# Altium project motion_board.PrjPcb
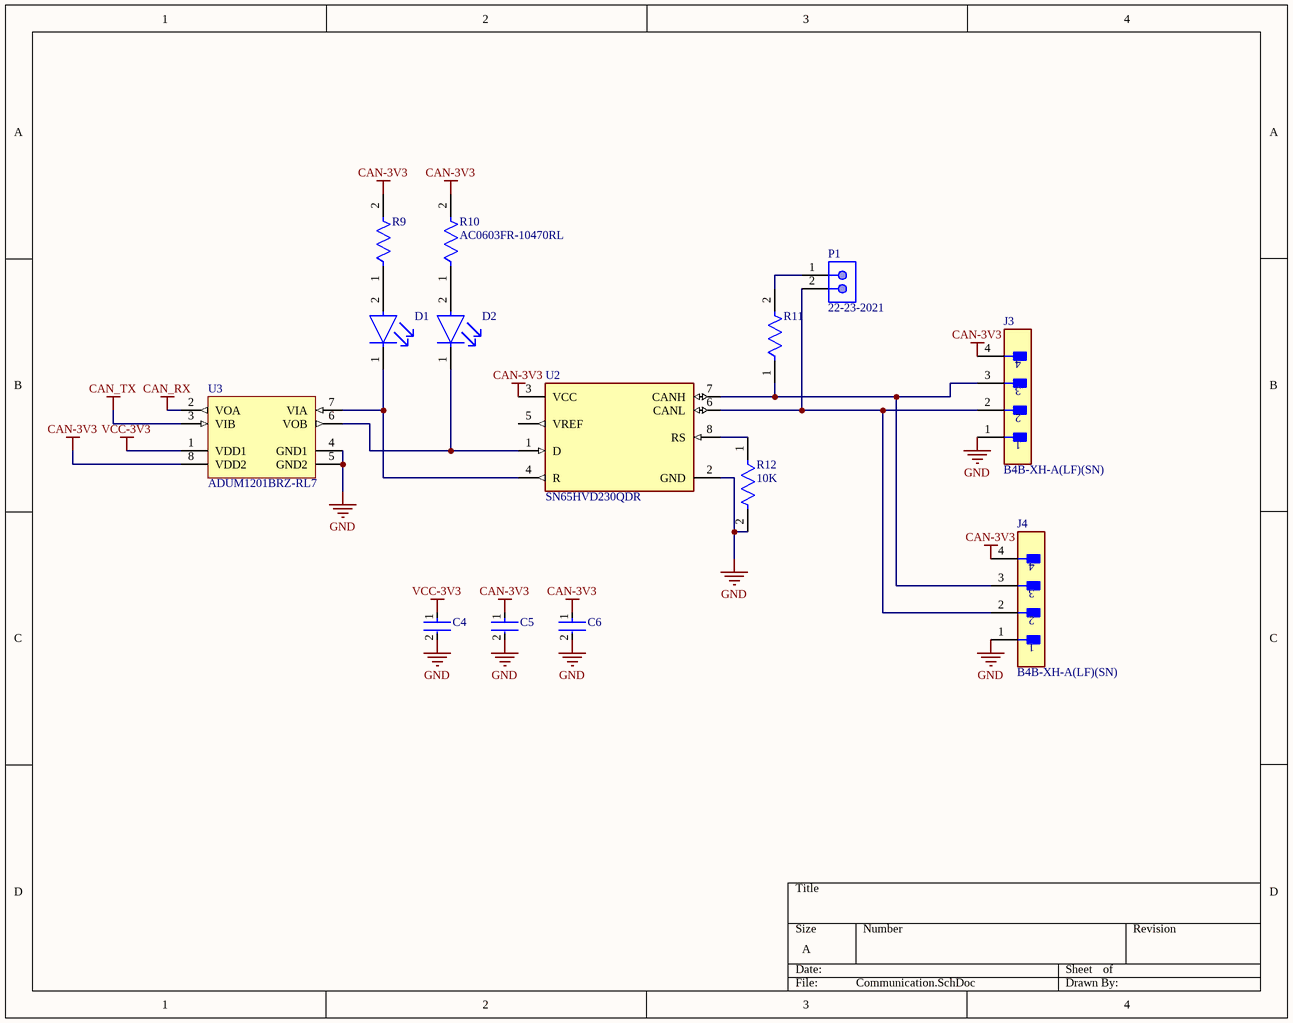
[diagram p0: Communication.SchDoc]
10 sheets, 62 parts. Net scope: global (net labels, ports and power ports of the same name join across sheets).
Board file: PCB_new.PcbDoc
Sheets:
  Communication.SchDoc
  MotorEncoders.SchDoc
  OdomEncoders.SchDoc
  Power.SchDoc
  STM32.SchDoc
  VoltageRegulator_3v3.SchDoc
  STLink.SchDoc
  MotorShield.SchDoc
  Oscilator.SchDoc
  IMU.SchDoc

## Sheet Communication.SchDoc
size A; SheetNumber: 1; SheetTotal: 10

### Parts
C4  CC0603KRX7R9BB104  [FP-CC0603-DA-MFG]  (value not drawn)
C5  CC0603KRX7R9BB104  [FP-CC0603-DA-MFG]  (value not drawn)
C6  CC0603KRX7R9BB104  [FP-CC0603-DA-MFG]  (value not drawn)
D1  APHCM2012CGCK-F01  [FP-APHCM2012CGCK-F01-MFG]  (value not drawn)
D2  APHCM2012CGCK-F01  [FP-APHCM2012CGCK-F01-MFG]  (value not drawn)
J3  B4B-XH-A(LF)(SN)  [FP-B4B-XH-A_LF_SN-MFG]
J4  B4B-XH-A(LF)(SN)  [FP-B4B-XH-A_LF_SN-MFG]
P1  22-23-2021  [MOLX-22-23-2021_V]
R9  AC0603FR-10470RL  [FP-AC0603-IPC_A]  (value not drawn)
R10  AC0603FR-10470RL  [FP-AC0603-IPC_A]
R11  RT0603FRE07120RL  [FP-RT0603-MFG]  (value not drawn)
R12  10K  [FP-RC0603-0_55-IPC_C]
U2  SN65HVD230QDR  [FP-D0008A-IPC_C]
U3  ADUM1201BRZ-RL7  [ADI-R-8_L]

### Nets
CAN-3V3: C5.1 C6.1 J3.4 J4.4 R9.2 R10.2 U2.3(VCC) U3.8(VDD2)
CAN_RX: U3.2(VOA)
CAN_TX: U3.3(VIB)
GND: C4.2 C5.2 C6.2 J3.1 J4.1 R12.2 U2.2(GND) U3.4(GND1) U3.5(GND2)
VCC-3V3: C4.1 U3.1(VDD1)
NetD1_1: D1.1(C) U2.4(R) U3.7(VIA)
NetD1_2: D1.2(A) R9.1
NetD2_1: D2.1(C) U2.1(D) U3.6(VOB)
NetD2_2: D2.2(A) R10.1
NetJ3_2: J3.2 J4.2 P1.2 U2.6(CANL)
NetJ3_3: J3.3 J4.3 R11.1 U2.7(CANH)
NetP1_1: P1.1 R11.2
NetR12_1: R12.1 U2.8(RS)

Not connected (* = marked no-connect by the designer): U2 5(VREF)

### Library data of the parts
C4-C6 = CMP-2100-03601-2: CAP CER 0.1UF 50V X7R 0603; Manufacturer: YAGEO; Material: Ceramic; Capacitance: 100 nF; Temperature Coefficient: 15%; Tolerance: 0.1; Value: 100 nF; Height: 0.9mm; Voltage: 50 V; ComponentLink2Description: Datasheet; Device Class L2: Capacitors; Temperature Range High: +125°C; Category: Cap; Footprint Url: http://www.yageo.com/exep/pages/download/literatures/UPY-C_GEN_24.pdf; ComponentLink2URL: http://www.yageo.com/documents/recent/UPY-GPHC_X7R_6.3V-to-50V_18.pdf; Package: CC0603-DA; Temperature: -55°C to +125°C; Voltage Rating: 50 V; Temperature Characteristic: X7R; Device Class L1: Passive Components; Temperature Range Low: -55°C; Manufacturer Part Number: CC0603KRX7R9BB104; RoHS: TRUE; Automotive: No; Device Class L3: Ceramic Capacitors; Octopart: https://octopart.com/cc0603krx7r9bb104-yageo-42244635; Mouser Description: Multilayer Ceramic Capacitor, CC Series, 0.1 - F, - 10%, X7R, 50 V, 0603 [1608 Metric]; Lead Free: Yes; Digikey Description: CAP CER 0.1UF 50V X7R 0603
D1 D2 = CMP-44529-000062-1: LED GREEN CLEAR CHIP SMD; Dominant Wavelength: 570nm; Forward Current: 20mA; Number of LEDs: 1; Luminous Intensity: 40mcd; Forward Voltage: 2.1V; Viewing Angle: 110°; Illumination Color: Green; Lens Style: Clear; Mount: Surface Mount; Length: 2mm; Max Operating Temperature: 85°C; Series: APHCM; Width: 1.25mm; Lead Free: Lead Free; Wavelength: 570nm; Package Quantity: 1; Number of Pins: 2; Case Code (Metric): 2012; RoHS Compliant: Yes; Packaging: Tape and Reel; Lens Color: Clear; Case/Package: 0805; Case Code (Imperial): 0805; Test Current: 20mA; Color: Green; Min Operating Temperature: -40°C; Height: 0.4mm
J3 J4 = CMP-17439-000250-1: CONN HEADER VERT 4POS 2.5MM; Number of Contacts: 4; Contact Resistance: 20mR; Voltage Rating: 250V; Max Current Rating: 3A; Gender: Male; Wire/Cable Gauge: 22AWG; Mated Stacking Heights: 9.8mm; Insulation Resistance: 1GR; Orientation: Straight; Contact Type: Male Pin; Contact Finish - Mating: TIN; Series: XH; Max Voltage Rating (AC): 250V; Lead Pitch: 2.5mm; Contact Shape: Square; Insulation Color: Natural; Termination: Solder; Lead Free: Lead Free; Voltage Rating (AC): 250V; Number of Rows: 1; Flammability Rating: UL94 V-0; Number of Positions: 4; Max Operating Temperature: 85°C; Package Quantity: 500; Mount: Through Hole; REACH SVHC: No SVHC; Connector Type: Header; Insulation Material: Nylon; Fastening Type: Detent; Min Operating Temperature: -25°C; Housing Color: White; Packaging: Bulk; Contact Plating: Tin; Contact Material: Brass; Max Voltage Rating (DC): 250V; Housing Material: Polyamide; Color: Natural; Material: Polyamide; Pitch: 2.5mm; Depth: 5.75mm; Current Rating: 3A; Length: 12.4mm
P1 = CMP-1704-00001-3: Male Header, Pitch 2.54 mm, 1 x 2 Position, Height 10.67 mm, Tail Length 3.56 mm, 0 to 75 degC, RoHS, Bulk; Package Quantity: 3000; Height: 10.67 mm; RoHSCompliant: True; ComponentLink2URL: https://datasheet.ciiva.com/19454/232266-19454304.pdf; PartNumber: 22-23-2021; Packaging: Bulk; ComponentLink2Description: Datasheet; Min Operating Temperature: 0 degC; ComponentLink1Description: Manufacturer URL; Length: 5.08 mm; Mounting Technology: Through Hole; Max Operating Temperature: 75 degC; REACH SVHC: Unknown; PackageDescription: Male Header, Pitch 2.54 mm, 1 x 2 Position, Height 10.67 mm, Tail Length 3.56 mm; ComponentLink1URL: http://www.molex.com/; Mount: Through Hole; Radiation Hardening: No; Width: 6.35 mm; Pins: 2
R9 R10 = CMP-03412-002877-2: RES 470Ω 1.00% 0.1W 0603; Tolerance: 1%; Resistance: 470R; Case/Package: 0603; RoHS Compliant: Yes
R11 = CMP-03412-010455-1: RES SMD 120 OHM 1% 1/10W 0603; Manufacturer: Yageo; Voltage Rating: 75V; Resistance: 120Ω; Value: 120Ω; Temperature Coefficient: 50 ppm/°C; Power Rating: 0.1W; Tolerance: 0.01; Ipc Land Pattern Name: RESC16080X45; Category: Res; Mouser Description: High Precision-High Stability Chip Resistor Thin Film 0603 120Ohm 1% Paper T/R; Series: RT; Device Class L1: Passive Components; Height: 0.55mm; Composition: Thin Film; Temperature Range High: +155°C; Octopart: https://octopart.com/rt0603fre07120rl-yageo-40001924; RoHS: TRUE; Footprint Url: http://www.yageo.com/exep/pages/download/literatures/PYu-R_Mount_10.pdf; Manufacturer Part Number: RT0603FRE07120RL; Device Class L3: Chip SMD Resistors; Lead Free: Yes; Digikey Description: RES SMD 120 OHM 1% 1/10W 0603; ComponentLink2Description: Datasheet; Temperature: -55°C to +155°C; Package: RT0603; Device Class L2: Resistors; ComponentLink2URL: http://www.yageo.com/documents/recent/PYu-RT_1-to-0.01_RoHS_L_9.pdf; Temperature Range Low: -55°C; Automotive: No; JLCPCB: 0603WAF1200T5E
R12 = CMP-2100-03664-2: RES 10K OHM 1% 1/10W 0603; Voltage Rating: 75V; Voltage Rating (DC): 50V; Resistance: 10kR; Power Rating: 100mW; Temperature Coefficient: 100ppm/°C; Depth: 0.8mm; Termination: SMD/SMT; Resistor Type: Thick Film; Series: RC; Construction: Rectangular; Features: Moisture Resistant; Packaging: Tape and Reel; Min Operating Temperature: -55°C; Number of Terminations: 2; Lead Pitch: 0.3mm; RoHS Compliant: Yes; Case/Package: 0603; Resistance Tolerance: 1%; Military Standard: Not; Weight: 7.1E-05oz; Number of Pins: 2; Tolerance: 1%; Length: 1.6mm; Case Code (Imperial): 0603; Lead Free: Lead Free; Width: 0.8mm; Max Power Dissipation: 100mW; Height: 0.45mm; Max Operating Temperature: 155°C; Case Code (Metric): 1608; Size Code: 0603
U2 = CMP-0315-00033-3: IC TRANSCEIVER HALF 1/1 8SOIC; Max Supply Current: 17mA; Number of Receivers: 1; Data Rate: 1Mbps; Simplex/Duplex: Half Duplex; Receiver Hysteresis: 100mV; Min Supply Voltage: 3V; Max Supply Voltage: 3.6V; Operating Supply Voltage: 3.3V; Number of Pins: 8; RoHS Compliant: Yes; Case/Package: D; Number of Drivers: 1; Packaging: Tape and Reel; Weight: 0.002822oz; Max Operating Temperature: 125°C; Package Quantity: 2500; Min Operating Temperature: -40°C; Nominal Supply Current: 17mA; Radiation Hardening: No; Number of Transceivers: 1; Contact Plating: Gold; Lead Free: Lead Free
U3 = CMP-0534-00027-1: Dual Channel Digital Isolator, 2.5 KV rms Insulation Rating, 10 Mbps Data Rate, 50 ns Delay, Industrial, 8-pin SOIC (R-8), Reel; Manufacturer: Analog Devices; Insulation Rating (kVrms): 2.5; Max Data Rate: 10Mbps; Code_JEDEC: MS-012-AA; ComponentLink3URL: http://www.analog.com/static/imported-files/packages/PKG_PDF/SOIC_Narrow%20(R)/R_8.pdf; PackageDescription: 8-Pin Standard Small Outline Package, Body 4.9 x 3.9 mm, Pitch 1.27 mm; ComponentLink2URL: http://www.analog.com/static/imported-files/data_sheets/ADuM1200_1201.pdf; DatasheetVersion: Rev. I; ComponentLink1URL: http://www.analog.com/en/index.html; PartNumber: ADUM1201BRZ-RL7; Mounting Technology: Surface Mount; ComponentLink3Description: Package Specification; ComponentLink1Description: Manufacturer URL; PackageVersion: 060506-A, 06/2006; ComponentLink2Description: Datasheet; Max Operating Temp (degreesC): 125; PackageReference: R-8; ComponentLink4URL: Product URL:http://www.analog.com/en/interface-isolation/digital-isolators/adum1201/products/product.html; ComponentLink4Description: URL Link1; ComponentLink5URL: Reference Circuit:http://www.analog.com/en/interface-isolation/digital-isolators/adum1201/products/product.html#product-recommendations; ComponentLink5Description: URL Link2

## Sheet MotorEncoders.SchDoc
size A; SheetNumber: 2; SheetTotal: 10
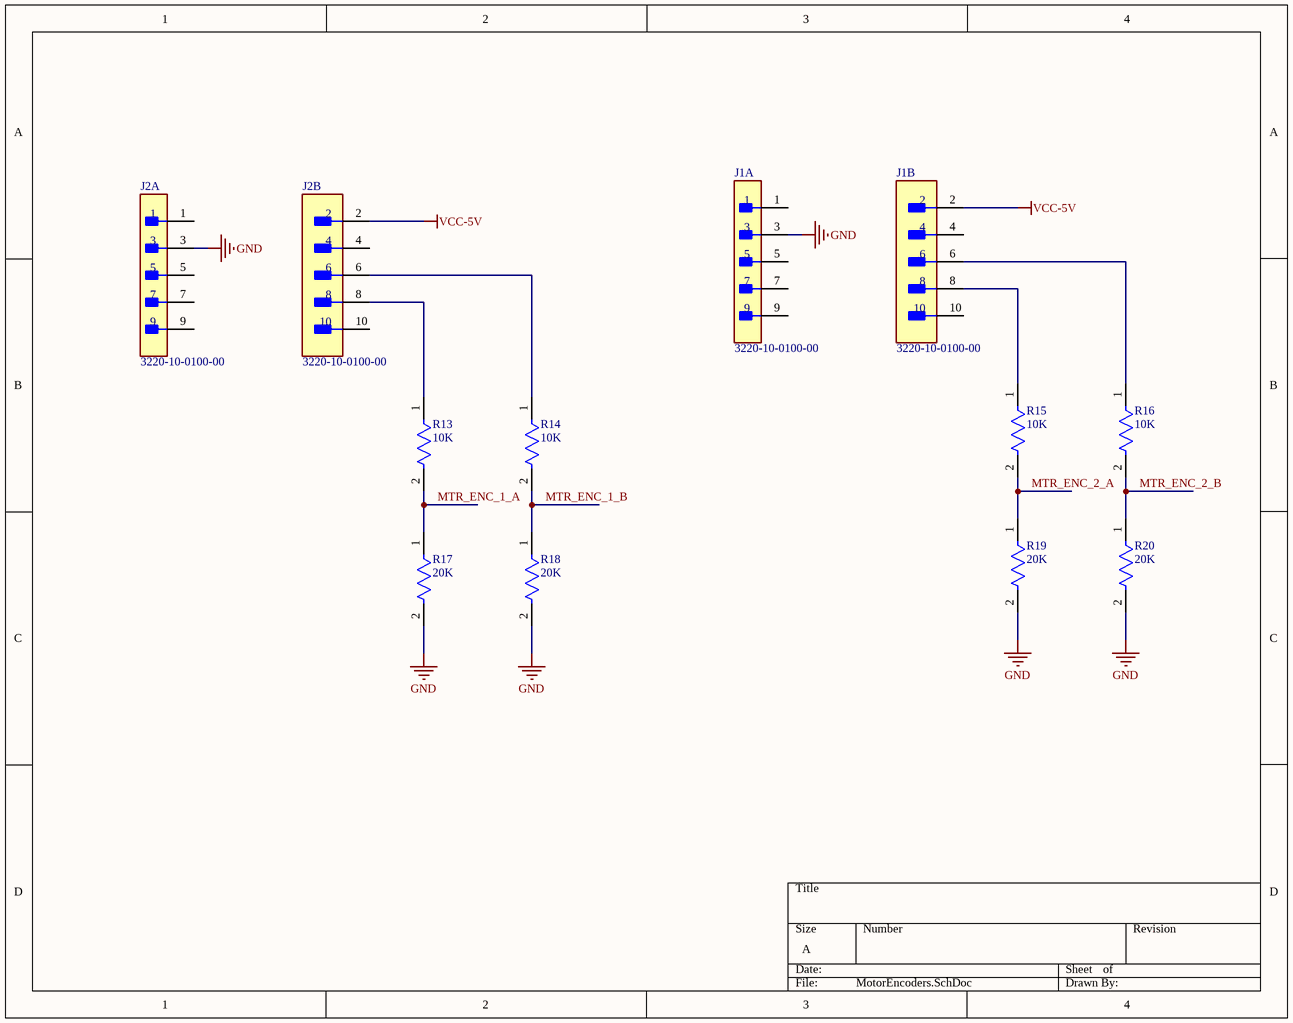
[diagram p1: MotorEncoders.SchDoc]

### Parts
J1  3220-10-0100-00  [FP-3220-10-0100-00-MFG]  (parts A,B of 2)
J2  3220-10-0100-00  [FP-3220-10-0100-00-MFG]  (parts A,B of 2)
R13  10K  [FP-RC0603-0_55-IPC_C]
R14  10K  [FP-RC0603-0_55-IPC_C]
R15  10K  [FP-RC0603-0_55-IPC_C]
R16  10K  [FP-RC0603-0_55-IPC_C]
R17  20K  [FP-RC0603-0_55-IPC_C]
R18  20K  [FP-RC0603-0_55-IPC_C]
R19  20K  [FP-RC0603-0_55-IPC_C]
R20  20K  [FP-RC0603-0_55-IPC_C]

### Nets
GND: J1.3 J2.3 R17.2 R18.2 R19.2 R20.2
VCC-5V: J1.2 J2.2
MTR_ENC_1_A: R13.2 R17.1
MTR_ENC_1_B: R14.2 R18.1
MTR_ENC_2_A: R15.2 R19.1
MTR_ENC_2_B: R16.2 R20.1
NetJ1_6: J1.6 R16.1
NetJ1_8: J1.8 R15.1
NetJ2_6: J2.6 R14.1
NetJ2_8: J2.8 R13.1

Not connected (* = marked no-connect by the designer): J1 1 4 5 7 9 10; J2 1 4 5 7 9 10

### Library data of the parts
J1 J2 = CMP-04151-26714221-1: 3220-10-0100-00 Conn Shrouded Header (4 Sides) HDR 10 POS 1.27mm Solder ST Top Entry Thru-Hole; Current Rating: 1A; Number of Contacts: 10; Connector Type: Male Pin; Contact Plating: Gold; Max Operating Temperature: 105°C; Contact Material: Gold; Number of Positions: 10; Pitch: 1.27mm; Number of Rows: 2; RoHS: Compliant; Row Spacing: 1.27mm; Min Operating Temperature: -40°C; Termination: Solder; NexarPartId: 26714221; Height: 5.6mm; Mount: Through Hole
R13-R16 = CMP-2100-03664-2: as R12 on sheet Communication; Depth: 0.8mm; Termination: SMD/SMT; Resistor Type: Thick Film; Series: RC; Construction: Rectangular; Features: Moisture Resistant; Packaging: Tape and Reel; Min Operating Temperature: -55°C; Number of Terminations: 2; Lead Pitch: 0.3mm; RoHS Compliant: Yes; Case/Package: 0603; Resistance Tolerance: 1%; Military Standard: Not; Weight: 7.1E-05oz; Number of Pins: 2; Tolerance: 1%; Length: 1.6mm; Case Code (Imperial): 0603; Lead Free: Lead Free; Width: 0.8mm; Max Power Dissipation: 100mW; Height: 0.45mm; Max Operating Temperature: 155°C; Case Code (Metric): 1608; Size Code: 0603
R17-R20 = CMP-2000-06932-2: RES 20K OHM 1% 1/10W 0603; Voltage Rating: 50V; Temperature Coefficient: 100ppm/°C; Power Rating: 100mW; Resistance: 20kR; Height: 0.022inch; REACH SVHC: No SVHC; Case Code (Metric): 1608; Depth: 0.8mm; Tolerance: 1%; Min Operating Temperature: -55°C; Series: RC; RoHS Compliant: Yes; Resistor Type: Thick Film; Max Power Dissipation: 100mW; Features: Moisture Resistant; Max Operating Temperature: 155°C; Package Quantity: 1; Size Code: 0603; Packaging: Tape and Reel; Width: 0.031inch; Length: 0.063inch; Military Standard: Not; Technology: THICK FILM; Number of Terminations: 2; Termination: SMD/SMT; Construction: Rectangular; Case/Package: 0603; Number of Pins: 2; Lead Free: Lead Free; Voltage Rating (DC): 50V; Resistance Tolerance: 1%; Case Code (Imperial): 0603

## Sheet OdomEncoders.SchDoc
size A; SheetNumber: 3; SheetTotal: 10
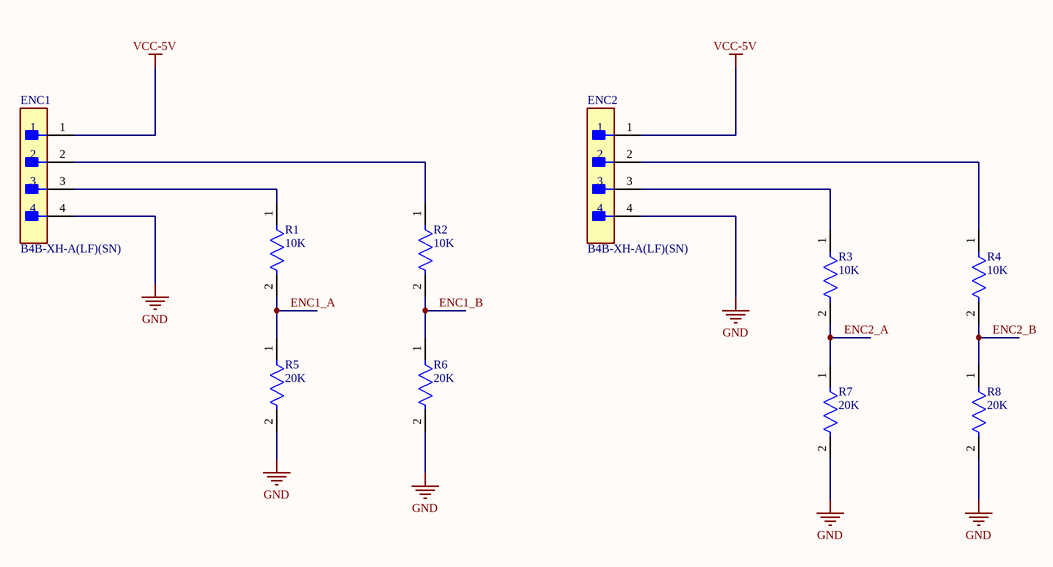
[diagram p2: OdomEncoders.SchDoc]

### Parts
ENC1  B4B-XH-A(LF)(SN)  [FP-B4B-XH-A_LF_SN-MFG]
ENC2  B4B-XH-A(LF)(SN)  [FP-B4B-XH-A_LF_SN-MFG]
R1  10K  [FP-RC0603-0_55-IPC_C]
R2  10K  [FP-RC0603-0_55-IPC_C]
R3  10K  [FP-RC0603-0_55-IPC_C]
R4  10K  [FP-RC0603-0_55-IPC_C]
R5  20K  [FP-RC0603-0_55-IPC_C]
R6  20K  [FP-RC0603-0_55-IPC_C]
R7  20K  [FP-RC0603-0_55-IPC_C]
R8  20K  [FP-RC0603-0_55-IPC_C]

### Nets
GND: ENC1.4 ENC2.4 R5.2 R6.2 R7.2 R8.2
VCC-5V: ENC1.1 ENC2.1
ENC1_A: R1.2 R5.1
ENC1_B: R2.2 R6.1
ENC2_A: R3.2 R7.1
ENC2_B: R4.2 R8.1
NetENC1_2: ENC1.2 R2.1
NetENC1_3: ENC1.3 R1.1
NetENC2_2: ENC2.2 R4.1
NetENC2_3: ENC2.3 R3.1

### Library data of the parts
ENC1 ENC2 = CMP-17439-000250-1: as J3 on sheet Communication; Orientation: Straight; Contact Type: Male Pin; Contact Finish - Mating: TIN; Series: XH; Max Voltage Rating (AC): 250V; Lead Pitch: 2.5mm; Contact Shape: Square; Insulation Color: Natural; Termination: Solder; Lead Free: Lead Free; Voltage Rating (AC): 250V; Number of Rows: 1; Flammability Rating: UL94 V-0; Number of Positions: 4; Max Operating Temperature: 85°C; Package Quantity: 500; Mount: Through Hole; REACH SVHC: No SVHC; Connector Type: Header; Insulation Material: Nylon; Fastening Type: Detent; Min Operating Temperature: -25°C; Housing Color: White; Packaging: Bulk; Contact Plating: Tin; Contact Material: Brass; Max Voltage Rating (DC): 250V; Housing Material: Polyamide; Color: Natural; Material: Polyamide; Pitch: 2.5mm; Depth: 5.75mm; Current Rating: 3A; Length: 12.4mm
R1-R4 = CMP-2100-03664-2: as R12 on sheet Communication; Depth: 0.8mm; Termination: SMD/SMT; Resistor Type: Thick Film; Series: RC; Construction: Rectangular; Features: Moisture Resistant; Packaging: Tape and Reel; Min Operating Temperature: -55°C; Number of Terminations: 2; Lead Pitch: 0.3mm; RoHS Compliant: Yes; Case/Package: 0603; Resistance Tolerance: 1%; Military Standard: Not; Weight: 7.1E-05oz; Number of Pins: 2; Tolerance: 1%; Length: 1.6mm; Case Code (Imperial): 0603; Lead Free: Lead Free; Width: 0.8mm; Max Power Dissipation: 100mW; Height: 0.45mm; Max Operating Temperature: 155°C; Case Code (Metric): 1608; Size Code: 0603
R5-R8 = CMP-2000-06932-2: as R17 on sheet MotorEncoders; Height: 0.022inch; REACH SVHC: No SVHC; Case Code (Metric): 1608; Depth: 0.8mm; Tolerance: 1%; Min Operating Temperature: -55°C; Series: RC; RoHS Compliant: Yes; Resistor Type: Thick Film; Max Power Dissipation: 100mW; Features: Moisture Resistant; Max Operating Temperature: 155°C; Package Quantity: 1; Size Code: 0603; Packaging: Tape and Reel; Width: 0.031inch; Length: 0.063inch; Military Standard: Not; Technology: THICK FILM; Number of Terminations: 2; Termination: SMD/SMT; Construction: Rectangular; Case/Package: 0603; Number of Pins: 2; Lead Free: Lead Free; Voltage Rating (DC): 50V; Resistance Tolerance: 1%; Case Code (Imperial): 0603

## Sheet Power.SchDoc
size A; SheetNumber: 4; SheetTotal: 10
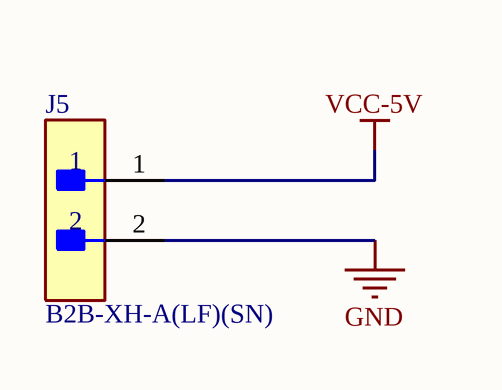
[diagram p3: Power.SchDoc]

### Parts
J5  B2B-XH-A(LF)(SN)  [FP-B2B-XH-A_LF_SN-MFG]

### Nets
GND: J5.2
VCC-5V: J5.1

### Library data of the parts
J5 = CMP-2000-05888-3: CONN HEADER VERT 2POS 2.5MM; Current Rating: 3A; Voltage Rating: 250V; Number of Contacts: 2; Contact Resistance: 20mR; Wire/Cable Gauge: 22AWG; Insulation Resistance: 1GR; Connector Type: Male Pin; Packaging: Bulk; Contact Material: Brass; Lead Free: Lead Free; Orientation: Straight; Contact Plating: Tin; Max Current Rating: 3A; Termination: Solder; Fastening Type: Detent; Depth: 5.75mm; Housing Material: Polyamide; REACH SVHC: No SVHC; Series: XH; Voltage Rating (AC): 250V; Number of Positions: 2; Color: Natural; Contact Type: Male Pin; Max Voltage Rating (DC): 250V; Pitch: 2.5mm; Lead Pitch: 2.5mm; Mount: Through Hole; Max Operating Temperature: 85°C; Length: 7.4mm; Max Voltage Rating (AC): 250V; Min Operating Temperature: -25°C; Number of Rows: 1; Housing Color: White

## Sheet STM32.SchDoc
size A; SheetNumber: 5; SheetTotal: 10
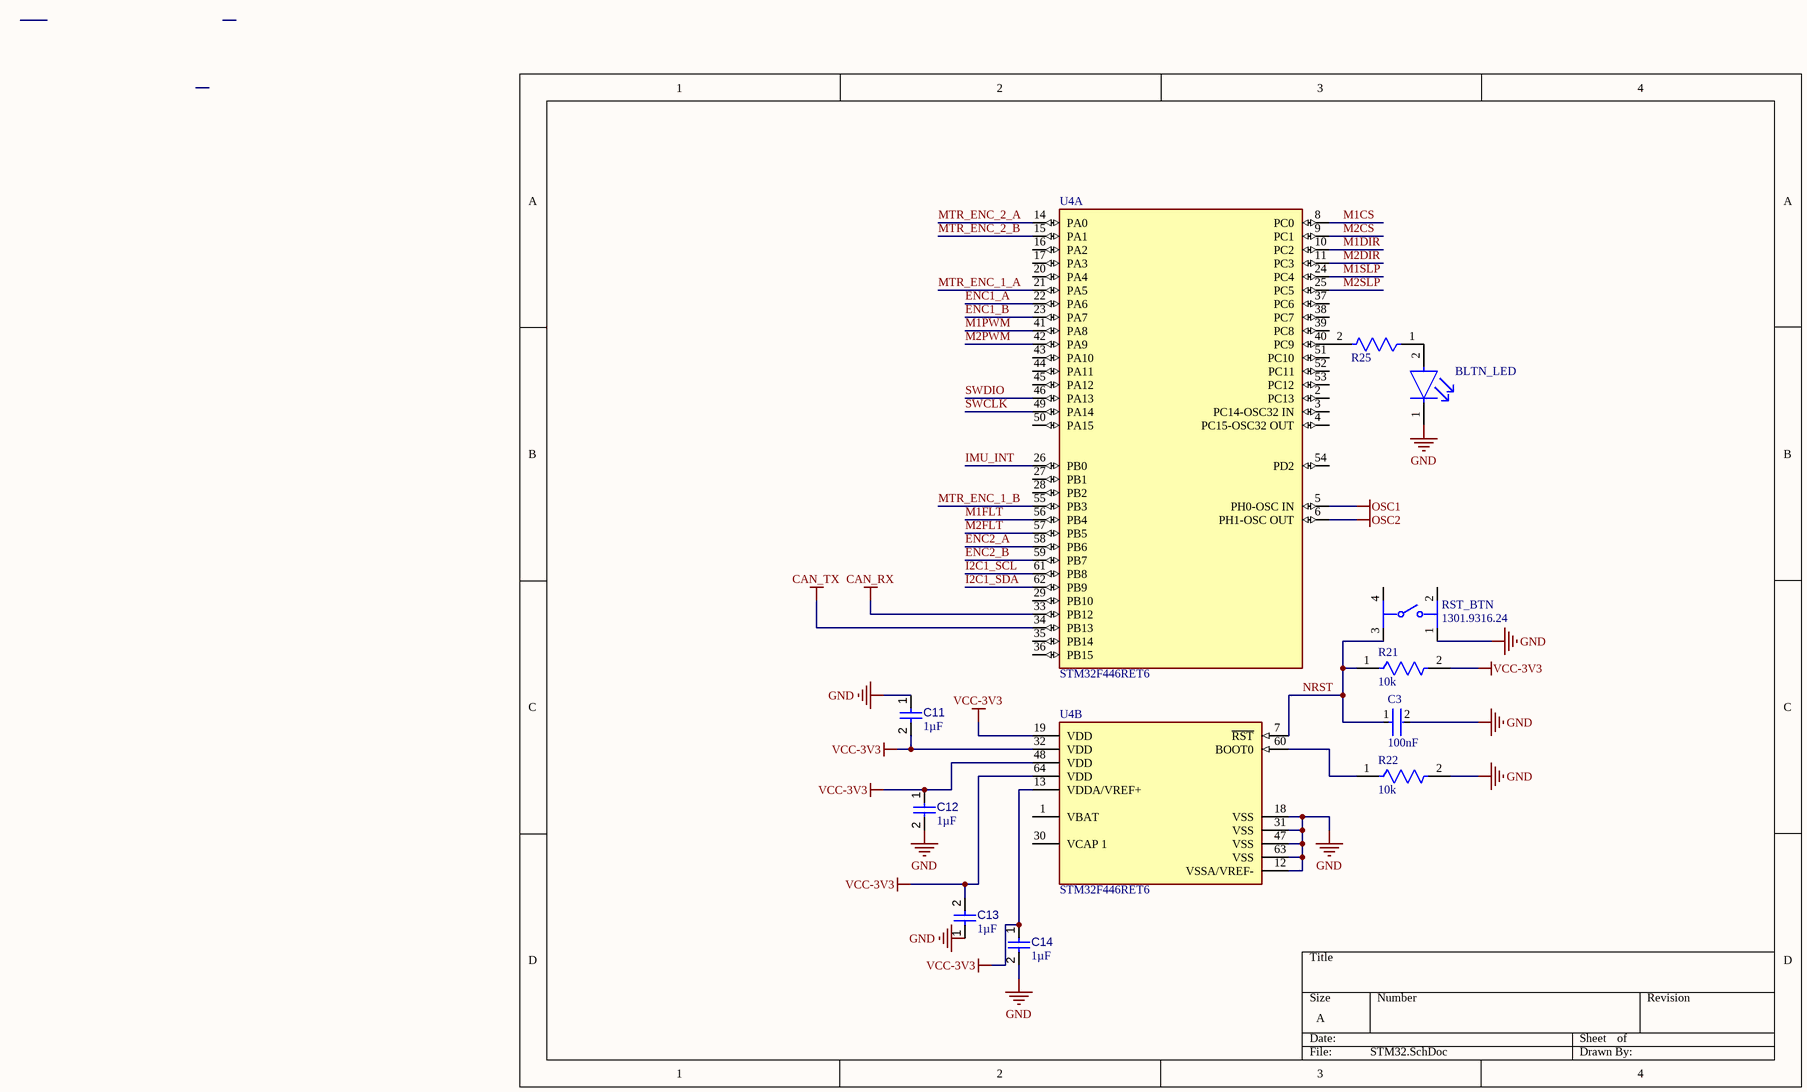
[diagram p4: STM32.SchDoc]

### Parts
BLTN_LED  APHCM2012CGCK-F01  [FP-APHCM2012CGCK-F01-MFG]  (value not drawn)
C3  100nF  [FP-0402B104K160CT-IPC_C]
C11  value 1µF  [CAPC0603(1608)100_L]  (hidden comment: Capacitor 1µF +/-40% 50V 0603)
C12  value 1µF  [CAPC0603(1608)100_L]  (hidden comment: Capacitor 1µF +/-40% 50V 0603)
C13  value 1µF  [CAPC0603(1608)100_L]  (hidden comment: Capacitor 1µF +/-40% 50V 0603)
C14  value 1µF  [CAPC0603(1608)100_L]  (hidden comment: Capacitor 1µF +/-40% 50V 0603)
R21  10k  [FP-RC0603-0_55-IPC_C]
R22  10k  [FP-RC0603-0_55-IPC_C]
R25  AC0603FR-10470RL  [FP-AC0603-IPC_A]  (value not drawn)
RST_BTN  1301.9316.24  [FP-1301_9316_24-MFG]
U4  STM32F446RET6  [FP-LQFP64-5W-MFG]  (parts A,B of 2)

### Nets
CAN_RX: U4.33(PB12)
CAN_TX: U4.34(PB13)
GND: BLTN_LED.1(C) C3.2 C11.1 C12.2 C13.1 C14.2 R22.2 RST_BTN.1 U4.12(VSSA/VREF-) U4.18(VSS) U4.31(VSS) U4.47(VSS) U4.63(VSS)
OSC1: U4.5(PH0-OSC_IN)
OSC2: U4.6(PH1-OSC_OUT)
VCC-3V3: C11.2 C12.1 C13.2 C14.1 R21.2 U4.13(VDDA/VREF+) U4.19(VDD) U4.32(VDD) U4.48(VDD) U4.64(VDD)
ENC1_A: U4.22(PA6)
ENC1_B: U4.23(PA7)
ENC2_A: U4.58(PB6)
ENC2_B: U4.59(PB7)
I2C1_SCL: U4.61(PB8)
I2C1_SDA: U4.62(PB9)
IMU_INT: U4.26(PB0)
M1CS: U4.8(PC0)
M1DIR: U4.10(PC2)
M1FLT: U4.56(PB4)
M1PWM: U4.41(PA8)
M1SLP: U4.24(PC4)
M2CS: U4.9(PC1)
M2DIR: U4.11(PC3)
M2FLT: U4.57(PB5)
M2PWM: U4.42(PA9)
M2SLP: U4.25(PC5)
MTR_ENC_1_A: U4.21(PA5)
MTR_ENC_1_B: U4.55(PB3)
MTR_ENC_2_A: U4.14(PA0)
MTR_ENC_2_B: U4.15(PA1)
NRST: C3.1 R21.1 RST_BTN.3 U4.7(~{RST})
SWCLK: U4.49(PA14)
SWDIO: U4.46(PA13)
NetBLTN_LED_2: BLTN_LED.2(A) R25.1
NetR22_1: R22.1 U4.60(BOOT0)
NetR25_2: R25.2 U4.40(PC9)

Not connected (* = marked no-connect by the designer): RST_BTN 2 4; U4 1(VBAT) 2(PC13) 3(PC14-OSC32_IN) 4(PC15-OSC32_OUT) 16(PA2) 17(PA3) 20(PA4) 27(PB1) 28(PB2) 29(PB10) 30(VCAP_1) 35(PB14) 36(PB15) 37(PC6) 38(PC7) 39(PC8) 43(PA10) 44(PA11) 45(PA12) 50(PA15) 51(PC10) 52(PC11) 53(PC12) 54(PD2)

### Library data of the parts
BLTN_LED = CMP-44529-000062-1: as D1 on sheet Communication; Illumination Color: Green; Lens Style: Clear; Mount: Surface Mount; Length: 2mm; Max Operating Temperature: 85°C; Series: APHCM; Width: 1.25mm; Lead Free: Lead Free; Wavelength: 570nm; Package Quantity: 1; Number of Pins: 2; Case Code (Metric): 2012; RoHS Compliant: Yes; Packaging: Tape and Reel; Lens Color: Clear; Case/Package: 0805; Case Code (Imperial): 0805; Test Current: 20mA; Color: Green; Min Operating Temperature: -40°C; Height: 0.4mm
C3 = CMP-45632-000002-1: CAP CER 0.1UF 16V X7R 0402; Tolerance: 10%; Case Code (Imperial): 0402; Length: 1mm; Radiation Hardening: No; Case Code (Metric): 1005; Max Operating Temperature: 125°C; Voltage Rating: 16V; Capacitance: 100nF; Voltage Rating (DC): 16V; Dielectric: X7R; RoHS Compliant: Yes; Packaging: Tape and Reel; Lead Free: Lead Free; Depth: 0.5mm; Case/Package: 0402; Min Operating Temperature: -55°C; Series: -
C11-C14 = CMP-001-00078-4: Chip Capacitor, 1µF +/-40%, 50V, 0603, Thickness 1 mm; Tolerance: 10%; Min Operating Temperature: -55°C; Max Operating Temperature: 85°C; Case/Package: 0603; Voltage Rating: 50V; Pins: 2; Mounting Technology: SMT
R21 R22 = CMP-2100-03664-2: as R12 on sheet Communication; Depth: 0.8mm; Termination: SMD/SMT; Resistor Type: Thick Film; Series: RC; Construction: Rectangular; Features: Moisture Resistant; Packaging: Tape and Reel; Min Operating Temperature: -55°C; Number of Terminations: 2; Lead Pitch: 0.3mm; RoHS Compliant: Yes; Case/Package: 0603; Resistance Tolerance: 1%; Military Standard: Not; Weight: 7.1E-05oz; Number of Pins: 2; Tolerance: 1%; Length: 1.6mm; Case Code (Imperial): 0603; Lead Free: Lead Free; Width: 0.8mm; Max Power Dissipation: 100mW; Height: 0.45mm; Max Operating Temperature: 155°C; Case Code (Metric): 1608; Size Code: 0603
R25 = CMP-03412-002877-2: as R9 on sheet Communication; Case/Package: 0603; RoHS Compliant: Yes
RST_BTN = CMP-26321-000004-1: LSH 6X6 SHORT TRAVEL SWITCH 7.00; Voltage Rating (DC): 12V; Mechanical Life: 100000Cycles; Throw Configuration: SPST; Operating Force: 1.6N; Max Current Rating: 50mA; Min Operating Temperature: -20°C; Mount: Surface Mount; Max Voltage Rating (DC): 12V; Length: 6mm; Packaging: Tape and Reel; Case/Package: SMD/SMT; Radiation Hardening: No; Orientation: Straight; Termination: Gull Wing; RoHS Compliant: Yes; Max Operating Temperature: 70°C; Depth: 10mm
U4 = CMP-12105-000007-1: IC MCU 32BIT 512KB FLASH 64LQFP; Manufacturer: ST; Number Of Spi Channels: 4; Ram Size: 128KBytes; Standoff Height: 0.05mm; Number Of Uart Channels: 6; Number Of Pwm Channels: 32; Max Junction Temp: +105°C; Number Of I/Os: 50; Number Of Usb Channels: 2; Frequency: 180MHz; Number Of A/D Converters: 3; Max Supply Voltage: 3.6V; Number Of Adc Channels: 16; Interface: I2C,SPI,UART,USART,CAN,USB,LIN,IrDA,I2S,Other; Memory Size: 512KBytes; Number Of Timers/Counters: 14; Min Supply Voltage: 1.7V; Core Architecture: ARM Cortex-M4; Data Bus Width: 32bits; Number Of Cores: 1; Ambient Temperature Range Low: -40°C; ComponentLink2URL: https://www.st.com/en/microcontrollers-microprocessors/stm32f446re.html; Category: IC; Height: 1.6mm; Ipc Land Pattern Name: QFP50P1200X1200X160-64; Manufacturer Part Number: STM32F446RET6; Octopart: https://octopart.com/stm32f446ret6-stmicroelectronics-52642920; Temperature Range High: +105°C; Lead Free: Yes; Mouser Description: ARM Microcontrollers - MCU High-performance and DSP with FP, ARM Cortex-M4 MCU with 512 Kbytes Flash, 180 MHz CPU, Art Accelerator, SDRAM; Digikey Description: IC MCU 32BIT 512KB FLASH 64LQFP; Ambient Temperature Range High: +85°C; Number Of I2C Channels: 4; Memory Type: FLASH; RoHS: TRUE; Automotive: No; Device Class L1: Integrated Circuits (ICs); Temperature: -40°C to +105°C; Device Class L2: Embedded Processors and Controllers; Device Class L3: Microcontrollers; Temperature Range Low: -40°C; Package: LQFP64-5W; ComponentLink2Description: Datasheet

## Sheet VoltageRegulator_3v3.SchDoc
size A; SheetNumber: 6; SheetTotal: 10
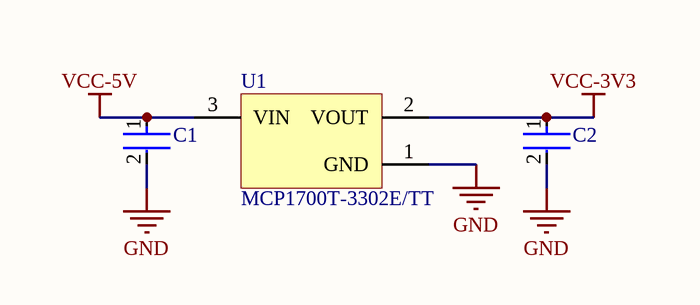
[diagram p5: VoltageRegulator_3v3.SchDoc]

### Parts
C1  CL10A105KO8NNNC  [FP-CL10-IPC_A]  (value not drawn)
C2  CL10A105KO8NNNC  [FP-CL10-IPC_A]  (value not drawn)
U1  MCP1700T-3302E/TT  [SOT-23-TT3_N]

### Nets
GND: C1.2 C2.2 U1.1(GND)
VCC-3V3: C2.1 U1.2(VOUT)
VCC-5V: C1.1 U1.3(VIN)

### Library data of the parts
C1 C2 = CMP-13271-001457-1: Cap Ceramic 1uF 16V X5R ±10% Pad SMD 0603 +85°C T/R; Dielectric: X5R; Height: 0.8mm; Capacitance: 1uF; Mount: Surface Mount; Thickness: 0.035inch; Width: 0.031inch; Min Operating Temperature: -55°C; Contact Plating: Tin; Case Code (Imperial): 0603; Depth: 0.8mm; Length: 1.6mm; Max Operating Temperature: 85°C; Packaging: Tape and Reel; Tolerance: 10%; Radiation Hardening: No; Case/Package: 0603; Package Quantity: 1; Voltage Rating: 16V; Case Code (Metric): 1608; Voltage: 16V; Material: Ceramic; Lead Free: Lead Free; Voltage Rating (DC): 16V
U1 = CMP-0136-00791-1: Low Quiescent Current LDO, 3-Pin SOT-23, Extended Temperature, Tape and Reel; PackageVersion: revBB, Aug-2009; Code_IPC: SOT23-3; PackageReference: SOT-23-TT3; DatasheetVersion: revB, Feb-2007; PackageDescription: 3-Lead Plastic Small Outline Transistor (TT) [SOT-23]

## Sheet STLink.SchDoc
size A; SheetNumber: 7; SheetTotal: 10
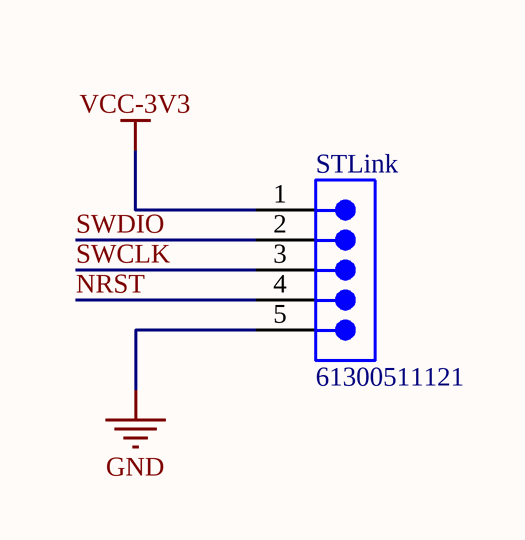
[diagram p6: STLink.SchDoc]

### Parts
STLink  61300511121  [61300511121]

### Nets
GND: STLink.5
VCC-3V3: STLink.1
NRST: STLink.4
SWCLK: STLink.3
SWDIO: STLink.2

### Library data of the parts
STLink = CMP-1502-01068-4: THT Vertical Pin Header WR-PHD, Pitch 2.54 mm, Single Row, 5 pins; Number of Contacts: 5; Connector Type: Male Pin; Operating Supply Voltage: 250V; Contact Resistance: 20mΩ; Gender: Male; Pitch: 2.54mm; Current Rating: 3A; Min Operating Temperature: -40°C; Contact Material: Gold; Color: Black; RoHS: Compliant; Number of Rows: 1; Lead Free: Lead Free; Height: 8.89mm; Contact Plating: Gold; Number of Pins: 5; Orientation: Vertical; Voltage Rating: 250V; Packaging: Bulk; Number of Positions: 5; Max Operating Temperature: 105°C; Termination: Solder; Lead Pitch: 2.54mm; Contact Mating Length: 5.9944mm; Mount: Through Hole

## Sheet MotorShield.SchDoc
size A; SheetNumber: 8; SheetTotal: 10
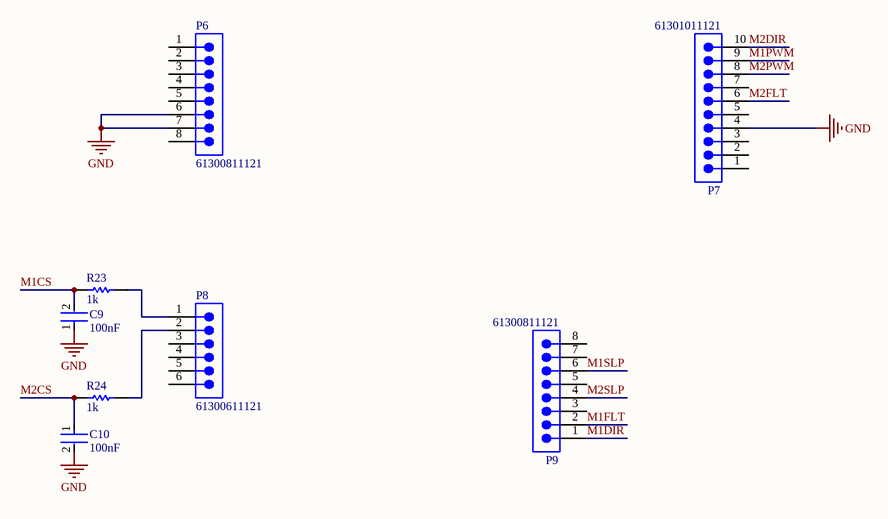
[diagram p7: MotorShield.SchDoc]

### Parts
C9  100nF  [FP-0402B104K160CT-IPC_C]
C10  100nF  [FP-0402B104K160CT-IPC_C]
P6  61300811121  [61300811121]
P7  61301011121  [61301011121]
P8  61300611121  [61300611121]
P9  61300811121  [61300811121]
R23  1k  [RESC1005X40X25NL05T05]
R24  1k  [RESC1005X40X25NL05T05]

### Nets
GND: C9.1 C10.2 P6.6 P6.7 P7.4
M1CS: C9.2 R23.1
M1DIR: P9.1
M1FLT: P9.2
M1PWM: P7.9
M1SLP: P9.6
M2CS: C10.1 R24.1
M2DIR: P7.10
M2FLT: P7.6
M2PWM: P7.8
M2SLP: P9.4
NetP8_1: P8.1 R23.2
NetP8_2: P8.2 R24.2

Not connected (* = marked no-connect by the designer): P6 1 2 3 4 5 8; P7 1 2 3 5 7; P8 3 4 5 6; P9 3 5 7 8

### Library data of the parts
C9 C10 = CMP-45632-000002-1: as C3 on sheet STM32; Case Code (Imperial): 0402; Length: 1mm; Radiation Hardening: No; Case Code (Metric): 1005; Max Operating Temperature: 125°C; Voltage Rating: 16V; Capacitance: 100nF; Voltage Rating (DC): 16V; Dielectric: X7R; RoHS Compliant: Yes; Packaging: Tape and Reel; Lead Free: Lead Free; Depth: 0.5mm; Case/Package: 0402; Min Operating Temperature: -55°C; Series: -
P6 P9 = CMP-1502-01076-4: THT Vertical Pin Header WR-PHD, Pitch 2.54 mm, Single Row, 8 pins; Pitch: 2.54mm; Voltage Rating: 250V; Connector Type: Male Pin; Current Rating: 3A; Contact Resistance: 20mΩ; Number of Positions: 8; Gender: Male; Contact Mating Length: 5.9944mm; Orientation: Vertical; Contact Plating: Gold; Mount: Through Hole; Min Operating Temperature: -40°C; Packaging: Bulk; Height: 8.54mm; Number of Pins: 8; Contact Material: Gold; Operating Supply Voltage: 250V; Termination: Solder; RoHS: Compliant; Color: Black; Number of Contacts: 8; Lead Pitch: 2.54mm; Number of Rows: 1; Max Operating Temperature: 105°C
P7 = CMP-1502-01082-6: THT Vertical Pin Header WR-PHD, Pitch 2.54 mm, Single Row, 10 pins; Gender: Male; Voltage Rating: 250V; Connector Type: Male Pin; Current Rating: 3A; Number of Contacts: 10; Pitch: 2.54mm; Contact Resistance: 20mΩ; Insulation Resistance: 1GΩ; RoHS: Compliant; Length: 2.54mm; Max Operating Temperature: 105°C; Flammability Rating: UL94 V-0; Width: 25.4mm; Number of Positions: 10; Number of Rows: 1; Lead Pitch: 2.54mm; Number of Pins: 10; Termination: Solder; Operating Supply Voltage: 250V; Color: Black; Housing Material: PBT; Orientation: Vertical; Packaging: Bulk; Mount: Through Hole; Contact Mating Length: 5.9944mm; Contact Material: Gold; Height: 8.74mm; Min Operating Temperature: -40°C; Contact Plating: Gold; Contact Gender: Male
P8 = CMP-1502-01070-4: THT Vertical Pin Header WR-PHD, Pitch 2.54 mm, Single Row, 6 pins; Pitch: 2.54mm; Operating Supply Voltage: 250V; Connector Type: Male Pin; Gender: Male; Number of Positions: 6; Contact Resistance: 20mΩ; Current Rating: 3A; Termination: Through Hole; Color: Black; Number of Pins: 6; Lead Pitch: 2.54mm; Height: 8.89mm; RoHS: Compliant; Lead Free: Lead Free; Contact Mating Length: 5.9944mm; Contact Plating: Gold; Contact Gender: Male; Packaging: Bulk; Orientation: Vertical; Mount: Through Hole; Voltage Rating: 250V; Number of Rows: 1; Max Operating Temperature: 105°C; Min Operating Temperature: -40°C; Housing Material: PBT; Contact Material: Gold; Number of Contacts: 6
R23 R24 = CMP-1011-00510-4: Chip Resistor, 1 KOhm, +/- 1%, 100 mW, -55 to 155 degC, 0402 (1005 Metric), RoHS, Tape and Reel; PartNumber: ERJ-2RKF1001X; Manufacturer: Basic Passives; Voltage Rating: 50 V; Case\/Package: 0402; Resistance: 1 KOhm; Power Rating: 100 mW; DatasheetVersion: 04/2015; Radiation Hardening: No; Pins: 2; Height: 0.35 mm; RoHSCompliant: true; Case Code (Imperial): 0402; ComponentLink2Description: Datasheet; ComponentLink1Description: Manufacturer URL; PackageReference: 0402; Mount: Surface Mount; Package Quantity: 10000; Tolerance: 1%; ComponentLink1URL: http://www.panasonic.com/; PackageDescription: 2-Pin Surface Mount Device, Body 1 x 0.5 mm; Mounting Technology: Surface Mount; Case Code (Metric): 1005; ComponentLink2URL: http://industrial.panasonic.com/cdbs/www-data/pdf/RDA0000/AOA0000C86.pdf; REACH SVHC: Yes; Packaging: Tape and Reel; Max Operating Temperature: 155 degC; Min Operating Temperature: -55 degC; Width: 0.5 mm; Length: 1 mm

## Sheet Oscilator.SchDoc
size A; SheetNumber: 9; SheetTotal: 10
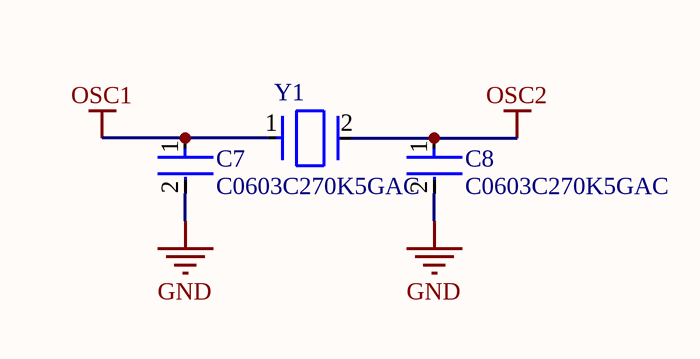
[diagram p8: Oscilator.SchDoc]

### Parts
C7  C0603C270K5GAC  [FP-C0603C-CF-MFG]
C8  C0603C270K5GAC  [FP-C0603C-CF-MFG]
Y1  ABM3-8.000MHZ-D2Y-T  [FP-ABM3-MFG]  (value not drawn)

### Nets
GND: C7.2 C8.2
OSC1: C7.1 Y1.1
OSC2: C8.1 Y1.2

### Library data of the parts
C7 C8 = CMP-03020-019774-1: C0603 27 pF C0G 30ppm/°C 10.00% 50 V; Manufacturer: KEMET; Tolerance: 0.1; Automotive Grade: Grade 1; Voltage Rating: 50 V; Capacitance: 27 pF; Material: Ceramic; Value: 27 pF; Package: C0603C-CF; Temperature: -55°C to +125°C; Device Class L1: Passive Components; Lead Free: Yes; Mouser Description: Multilayer Ceramic Capacitors MLCC - SMD/SMT 50volts 27pF 10% C0G; Temperature Coefficient: 30ppm/°C; Octopart: https://octopart.com/c0603c270k5gac-kemet-8089732; ComponentLink2Description: Datasheet; Manufacturer Part Number: C0603C270K5GAC; Device Class L3: Ceramic Capacitors; Category: Cap; Temperature Characteristic: C0G; Temperature Range Low: -55°C; Automotive: Yes; Height: 0.87mm; ComponentLink2URL: https://api.kemet.com/component-edge/download/datasheet/C0603C100J5GACAUTO.pdf; Temperature Range High: +125°C; Device Class L2: Capacitors; RoHS: TRUE
Y1 = CMP-2000-05033-2: Crystal 8MHz ±20ppm 18pF SMD-2 5mm x 3.2mm; Series Resistance: 500R; Frequency Stability: 30ppm; ESR (Equivalent Series Resistance): 140R; Load Capacitance: 18pF; Height: 0.051inch; Tolerance: 20ppm; Depth: 3.2mm; Max Operating Temperature: 85°C; Frequency: 8MHz; Termination: SMD/SMT; Lead Free: Lead Free; Number of Pins: 2; Width: 3.2mm; RoHS Compliant: Yes; Resistor Type: Ceramic; Length: 5mm; Mount: Surface Mount; Case/Package: CSMD; Package Quantity: 1000; Radiation Hardening: No; Min Operating Temperature: -40°C; Packaging: Tape and Reel; Frequency Tolerance: 20ppm

## Sheet IMU.SchDoc
size A; SheetNumber: 10; SheetTotal: 10
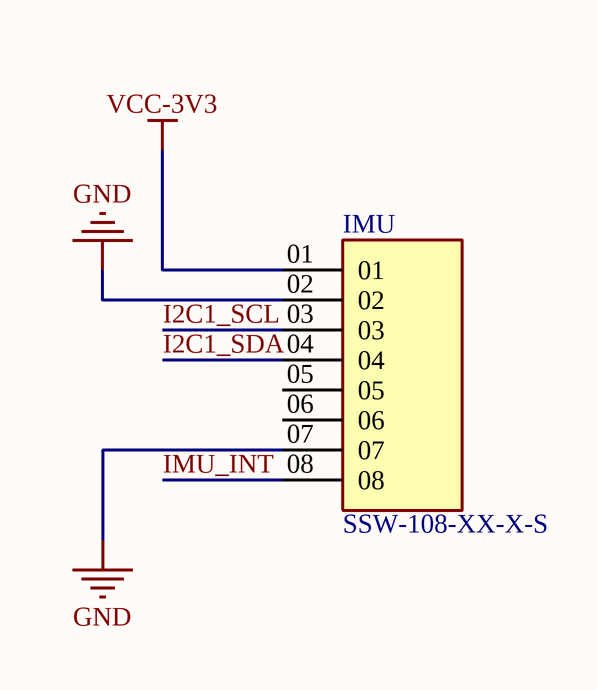
[diagram p9: IMU.SchDoc]

### Parts
IMU  SSW-108-XX-X-S  [SAMTEC_SSW-108-XX-X-S]

### Nets
GND: IMU.02 IMU.07
VCC-3V3: IMU.01
I2C1_SCL: IMU.03
I2C1_SDA: IMU.04
IMU_INT: IMU.08

Not connected (* = marked no-connect by the designer): IMU 05 06

### Library data of the parts
IMU = SSW-108-XX-X-S: 8 Position Receptacle Connector 0.100 (2.54mm) Through Hole, Right Angle Gold; MF: Samtec; MP: SSW-108-23-G-S; SnapEDA_Link: https://www.snapeda.com/parts/SSW-108-23-G-S/Samtec/view-part/?ref=snap; Package: None; Value: *; Check_prices: https://www.snapeda.com/parts/SSW-108-23-G-S/Samtec/view-part/?ref=eda

## Nets that join several sheets
CAN_RX: Communication (U3.2), STM32 (U4.33)
CAN_TX: Communication (U3.3), STM32 (U4.34)
GND: Communication (9 pins), MotorEncoders (6 pins), OdomEncoders (6 pins), Power (J5.2), STM32 (13 pins), VoltageRegulator_3v3 (C1.2 C2.2 U1.1), STLink (STLink.5), MotorShield (5 pins), Oscilator (C7.2 C8.2), IMU (IMU.02 IMU.07)
OSC1: STM32 (U4.5), Oscilator (C7.1 Y1.1)
OSC2: STM32 (U4.6), Oscilator (C8.1 Y1.2)
VCC-3V3: Communication (C4.1 U3.1), STM32 (10 pins), VoltageRegulator_3v3 (C2.1 U1.2), STLink (STLink.1), IMU (IMU.01)
VCC-5V: MotorEncoders (J1.2 J2.2), OdomEncoders (ENC1.1 ENC2.1), Power (J5.1), VoltageRegulator_3v3 (C1.1 U1.3)
ENC1_A: OdomEncoders (R1.2 R5.1), STM32 (U4.22)
ENC1_B: OdomEncoders (R2.2 R6.1), STM32 (U4.23)
ENC2_A: OdomEncoders (R3.2 R7.1), STM32 (U4.58)
ENC2_B: OdomEncoders (R4.2 R8.1), STM32 (U4.59)
I2C1_SCL: STM32 (U4.61), IMU (IMU.03)
I2C1_SDA: STM32 (U4.62), IMU (IMU.04)
IMU_INT: STM32 (U4.26), IMU (IMU.08)
M1CS: STM32 (U4.8), MotorShield (C9.2 R23.1)
M1DIR: STM32 (U4.10), MotorShield (P9.1)
M1FLT: STM32 (U4.56), MotorShield (P9.2)
M1PWM: STM32 (U4.41), MotorShield (P7.9)
M1SLP: STM32 (U4.24), MotorShield (P9.6)
M2CS: STM32 (U4.9), MotorShield (C10.1 R24.1)
M2DIR: STM32 (U4.11), MotorShield (P7.10)
M2FLT: STM32 (U4.57), MotorShield (P7.6)
M2PWM: STM32 (U4.42), MotorShield (P7.8)
M2SLP: STM32 (U4.25), MotorShield (P9.4)
MTR_ENC_1_A: MotorEncoders (R13.2 R17.1), STM32 (U4.21)
MTR_ENC_1_B: MotorEncoders (R14.2 R18.1), STM32 (U4.55)
MTR_ENC_2_A: MotorEncoders (R15.2 R19.1), STM32 (U4.14)
MTR_ENC_2_B: MotorEncoders (R16.2 R20.1), STM32 (U4.15)
NRST: STM32 (C3.1 R21.1 RST_BTN.3 U4.7), STLink (STLink.4)
SWCLK: STM32 (U4.49), STLink (STLink.3)
SWDIO: STM32 (U4.46), STLink (STLink.2)